# Altium schematic sheet Block Diagram.SchDoc
size B
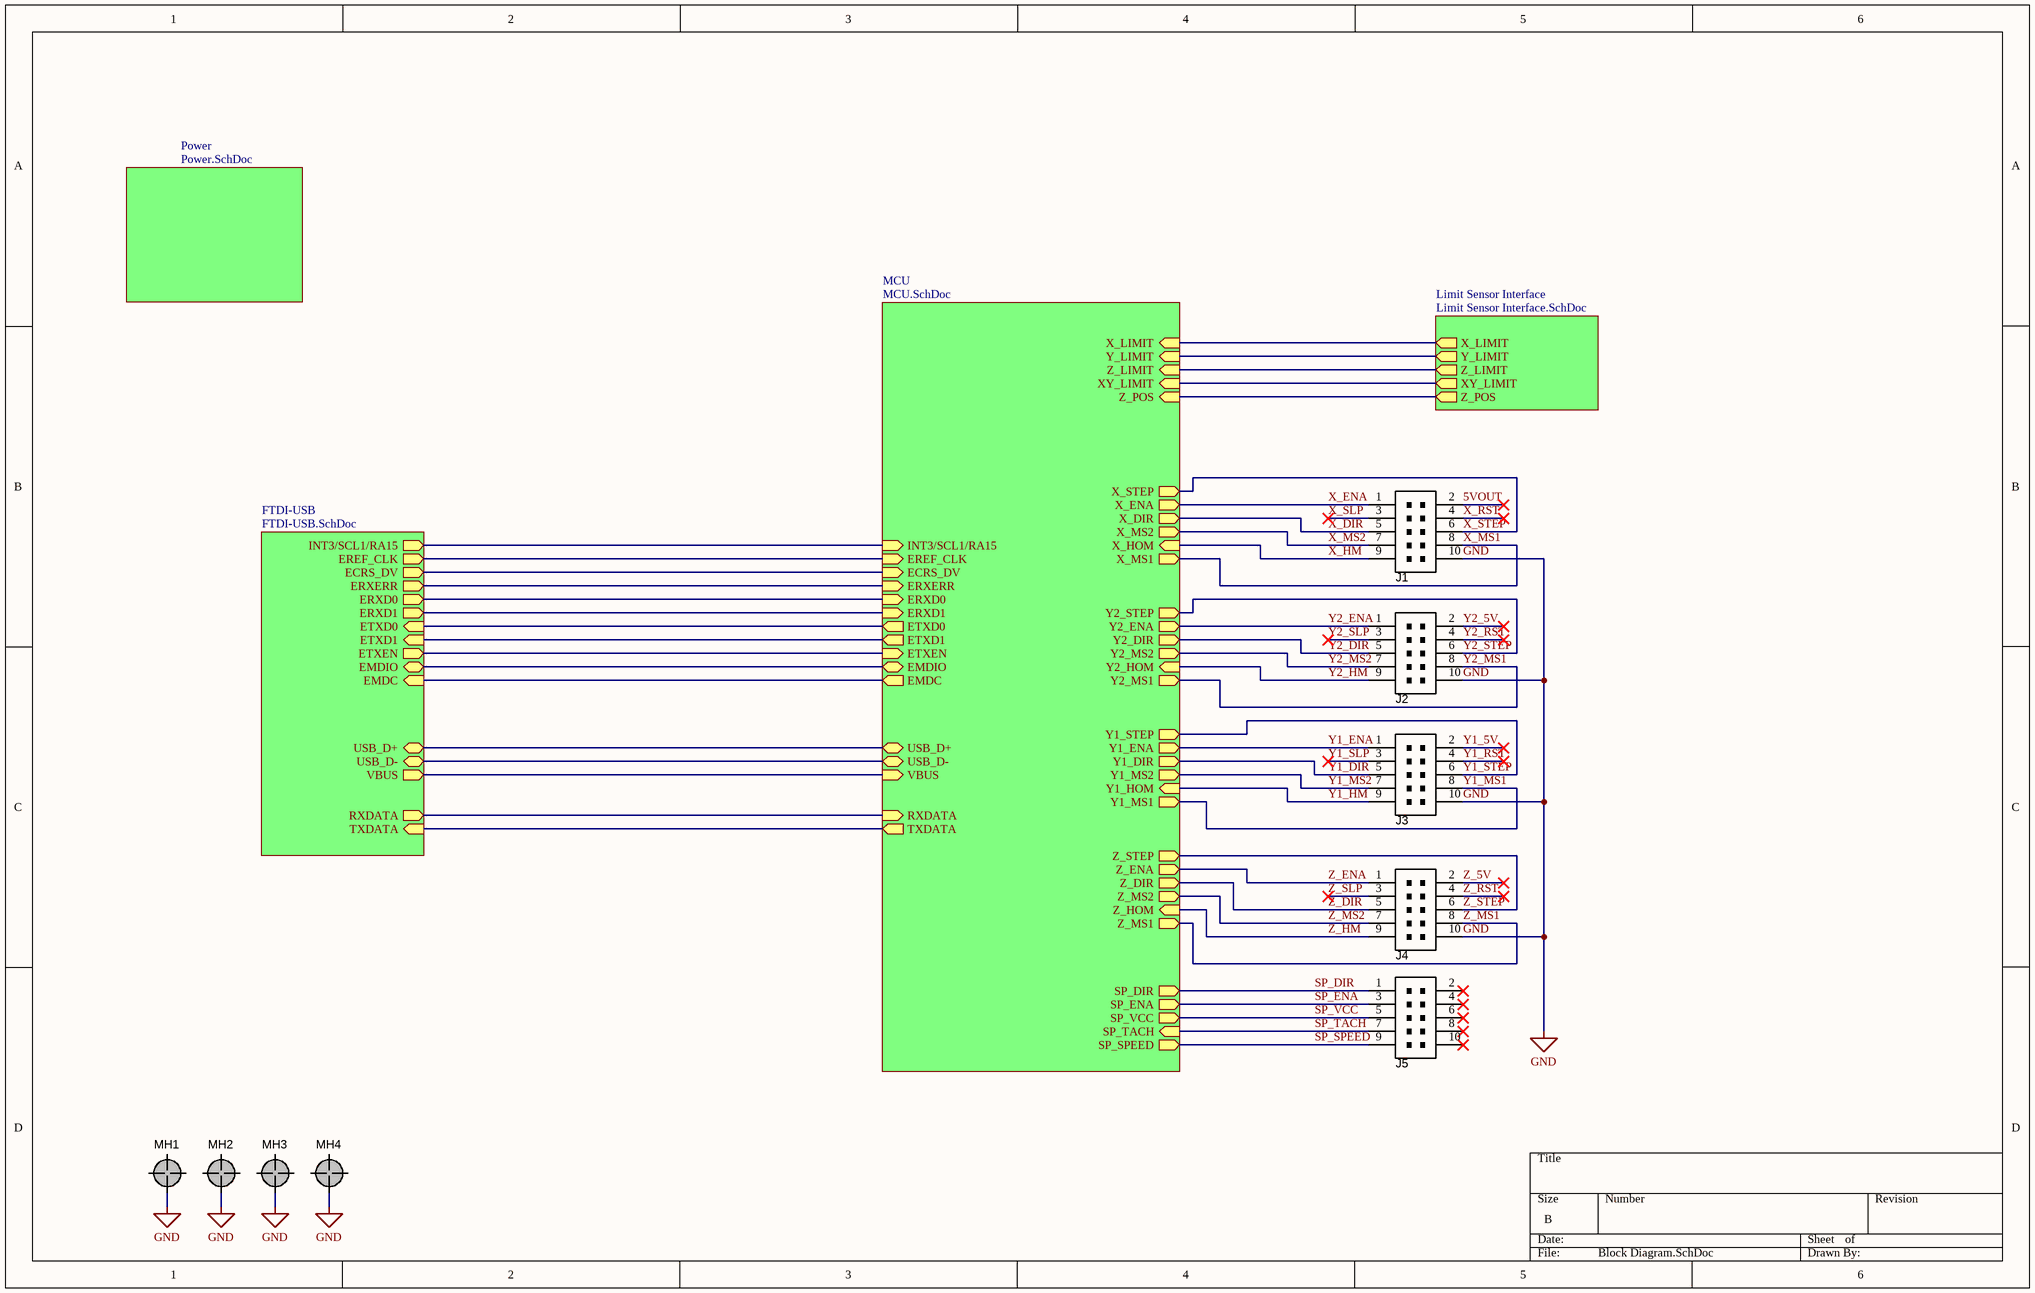
[diagram p0: Block Diagram.SchDoc]

## Parts
J1  shrouded box header  [10P_PCB_HEADER_BRD_MNT]  (value not drawn)
J2  shrouded box header  [10P_PCB_HEADER_BRD_MNT]  (value not drawn)
J3  shrouded box header  [10P_PCB_HEADER_BRD_MNT]  (value not drawn)
J4  shrouded box header  [10P_PCB_HEADER_BRD_MNT]  (value not drawn)
J5  shrouded box header  [10P_PCB_HEADER_BRD_MNT]  (value not drawn)
MH1  MH_Plated_125mil  [MH_PLATED_125 ID x 260mil OD]  (value not drawn)  (no BOM)
MH2  MH_Plated_125mil  [MH_PLATED_125 ID x 260mil OD]  (value not drawn)  (no BOM)
MH3  MH_Plated_125mil  [MH_PLATED_125 ID x 260mil OD]  (value not drawn)  (no BOM)
MH4  MH_Plated_125mil  [MH_PLATED_125 ID x 260mil OD]  (value not drawn)  (no BOM)

## Sub-sheets
FTDI-USB = FTDI-USB.SchDoc: INT3/SCL1/RA15 (out), EREF_CLK (out), ECRS_DV (out), ERXERR (out), ERXD0 (out), ETXD0 (in), ERXD1 (out), ETXD1 (in), ETXEN (out), EMDIO (bidir), EMDC (in), TXDATA (in), RXDATA (out), USB_D+, USB_D-, VBUS (out)
Limit Sensor Interface = Limit Sensor Interface.SchDoc: Y_LIMIT (out), Z_LIMIT (out), XY_LIMIT (out), Z_POS (out), X_LIMIT (out)
MCU = MCU.SchDoc: INT3/SCL1/RA15 (in), EREF_CLK (in), ECRS_DV (in), ERXERR (in), ERXD0 (in), ETXD0 (out), ERXD1 (in), ETXD1 (out), ETXEN (in), EMDIO (bidir), EMDC (out), TXDATA (out), RXDATA (in), USB_D+, USB_D-, VBUS (in), SP_DIR (out), SP_ENA (out), SP_VCC (out), SP_TACH (in), SP_SPEED (out), Z_ENA (out), Z_DIR (out), Z_MS2 (out), Z_MS1 (out), Z_HOM (in), Z_STEP (out), Y1_ENA (out), Y1_DIR (out), Y1_MS2 (out), Y1_MS1 (out), Y1_HOM (in), Y1_STEP (out), Y2_ENA (out), Y2_DIR (out), Y2_MS2 (out), Y2_MS1 (out), Y2_HOM (in), Y2_STEP (out), X_ENA (out), X_DIR (out), X_MS2 (out), X_MS1 (out), X_HOM (in), X_STEP (out), Y_LIMIT (in), Z_LIMIT (in), XY_LIMIT (in), Z_POS (in), X_LIMIT (in)
Power = Power.SchDoc: no entries

## Nets
GND: J1.10 J2.10 J3.10 J4.10 MH1.MH MH2.MH MH3.MH MH4.MH
5VOUT: J1.2
SP_DIR: J5.1 ; sheet MCU/SP_DIR
SP_ENA: J5.3 ; sheet MCU/SP_ENA
SP_SPEED: J5.9 ; sheet MCU/SP_SPEED
SP_TACH: J5.7 ; sheet MCU/SP_TACH
SP_VCC: J5.5 ; sheet MCU/SP_VCC
X_DIR: J1.5 ; sheet MCU/X_DIR
X_ENA: J1.1 ; sheet MCU/X_ENA
X_HM: J1.9 ; sheet MCU/X_HOM
X_MS1: J1.8 ; sheet MCU/X_MS1
X_MS2: J1.7 ; sheet MCU/X_MS2
X_RST: J1.4
X_SLP: J1.3
X_STEP: J1.6 ; sheet MCU/X_STEP
Y1_5V: J3.2
Y1_DIR: J3.5 ; sheet MCU/Y1_DIR
Y1_ENA: J3.1 ; sheet MCU/Y1_ENA
Y1_HM: J3.9 ; sheet MCU/Y1_HOM
Y1_MS1: J3.8 ; sheet MCU/Y1_MS1
Y1_MS2: J3.7 ; sheet MCU/Y1_MS2
Y1_RST: J3.4
Y1_SLP: J3.3
Y1_STEP: J3.6 ; sheet MCU/Y1_STEP
Y2_5V: J2.2
Y2_DIR: J2.5 ; sheet MCU/Y2_DIR
Y2_ENA: J2.1 ; sheet MCU/Y2_ENA
Y2_HM: J2.9 ; sheet MCU/Y2_HOM
Y2_MS1: J2.8 ; sheet MCU/Y2_MS1
Y2_MS2: J2.7 ; sheet MCU/Y2_MS2
Y2_RST: J2.4
Y2_SLP: J2.3
Y2_STEP: J2.6 ; sheet MCU/Y2_STEP
Z_5V: J4.2
Z_DIR: J4.5 ; sheet MCU/Z_DIR
Z_ENA: J4.1 ; sheet MCU/Z_ENA
Z_HM: J4.9 ; sheet MCU/Z_HOM
Z_MS1: J4.8 ; sheet MCU/Z_MS1
Z_MS2: J4.7 ; sheet MCU/Z_MS2
Z_RST: J4.4
Z_SLP: J4.3
Z_STEP: J4.6 ; sheet MCU/Z_STEP
(unnamed): sheet MCU/INT3/SCL1/RA15, sheet FTDI-USB/INT3/SCL1/RA15
(unnamed): sheet MCU/EREF_CLK, sheet FTDI-USB/EREF_CLK
(unnamed): sheet MCU/ECRS_DV, sheet FTDI-USB/ECRS_DV
(unnamed): sheet MCU/ERXERR, sheet FTDI-USB/ERXERR
(unnamed): sheet MCU/ERXD0, sheet FTDI-USB/ERXD0
(unnamed): sheet MCU/ETXD0, sheet FTDI-USB/ETXD0
(unnamed): sheet MCU/ERXD1, sheet FTDI-USB/ERXD1
(unnamed): sheet MCU/ETXD1, sheet FTDI-USB/ETXD1
(unnamed): sheet MCU/ETXEN, sheet FTDI-USB/ETXEN
(unnamed): sheet MCU/EMDIO, sheet FTDI-USB/EMDIO
(unnamed): sheet MCU/EMDC, sheet FTDI-USB/EMDC
(unnamed): sheet MCU/TXDATA, sheet FTDI-USB/TXDATA
(unnamed): sheet MCU/RXDATA, sheet FTDI-USB/RXDATA
(unnamed): sheet MCU/USB_D+, sheet FTDI-USB/USB_D+
(unnamed): sheet MCU/USB_D-, sheet FTDI-USB/USB_D-
(unnamed): sheet MCU/VBUS, sheet FTDI-USB/VBUS
(unnamed): sheet MCU/Y_LIMIT, sheet Limit Sensor Interface/Y_LIMIT
(unnamed): sheet MCU/Z_LIMIT, sheet Limit Sensor Interface/Z_LIMIT
(unnamed): sheet MCU/XY_LIMIT, sheet Limit Sensor Interface/XY_LIMIT
(unnamed): sheet MCU/Z_POS, sheet Limit Sensor Interface/Z_POS
(unnamed): sheet MCU/X_LIMIT, sheet Limit Sensor Interface/X_LIMIT

Not connected (* = marked no-connect by the designer): J5 2* 4* 6* 8* 10*

## Library data of the parts
J1-J5 = CONN_HEADER_2x5P_0.100in_Male: Header THD 10 POS Double-row 2.54mm pitch; Manufacturer 1: 3M; Manufacturer Part Number 1: D2510-6002-AR; Pitch: 0.100" (2.54mm); Value: Double-row, 10 positions; QtyOverride: 1; Connector Type: Header, Shrouded; Number of Positions: 10; SCDType: undef; Package / Case: Connector header; 2.54mm pitch; Contact Type: Male Pin; Number of Rows: 2; Row Spacing: 0.100" (2.54mm); Contact Mating Length: 0.243" (6.17mm); ComponentLink1URL: http://multimedia.3m.com/mws/mediawebserver?66666UuZjcFSLXTtm8T_oxMcEVuQEcuZgVs6EVs6E666666--; ComponentLink1Description: http://multimedia.3m.com/mws/mediawebserver?66666UuZjcFSLXTtm8T_oxMcEVuQEcuZgVs6EVs6E666666--; Supplier 1: Digi-Key; Supplier Part Number 1: MHC10E-ND
MH1-MH4 = MH_Plated_125mil: Rule: UNIONINDEX{}0[]SOLDERMASKEXPANSIONMODE{}None[]PASTEMASKEXPANSIONMODE{}None[]RULEKIND{}PlaneConnect[]NETSCOPE{}AnyNet[]LAYERKIND{}SameLayer[]NAME{}Schematic Power Plane Connect Style[]PLANECONNECTSTYLE{}Direct[]RELIEFEXPANSION{}15mil[]RELIEFENTRIES{}2[]RELIEFCONDUCTORWIDTH{}12mil[]RELIEFAIRGAP{}10mil[]UNIT{}Imperial[]PcbType{}ProtelPcb